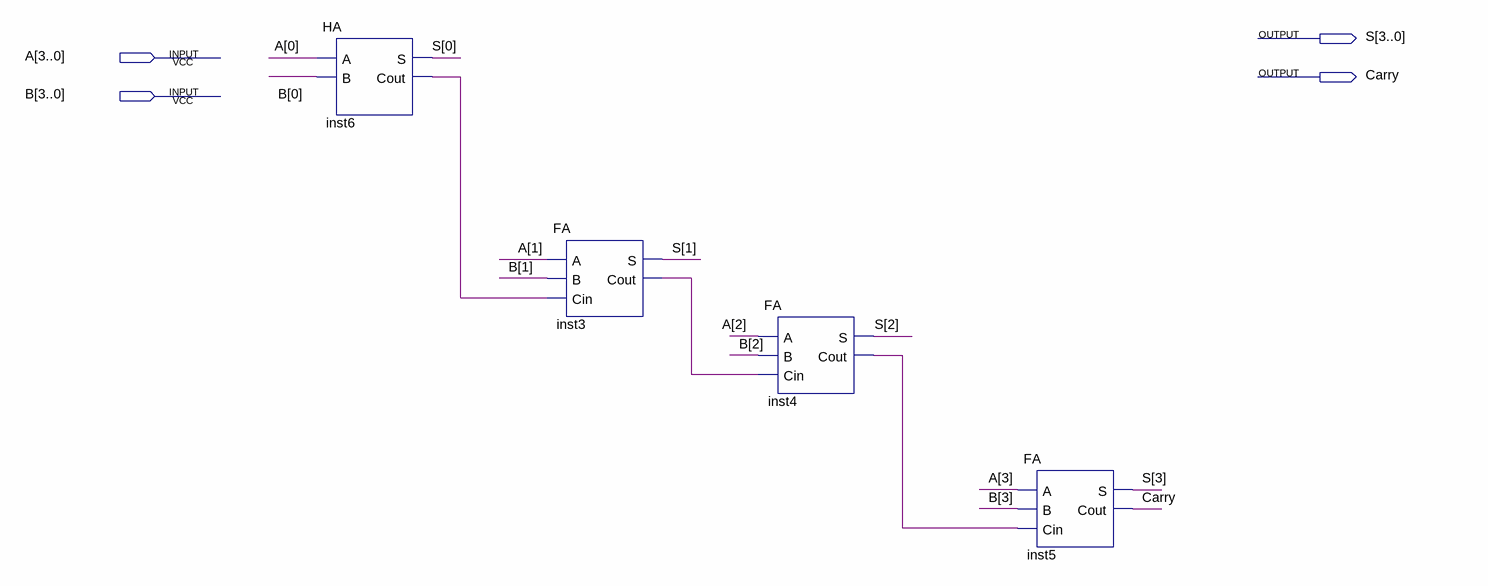
[diagram p0: schematic sheet]
// Quartus schematic Lab01.bdf as structural Verilog: 4 symbols, 4 pins
module Lab01 (
  input  [3:0] A,
  input  [3:0] B,
  output [3:0] S,
  output Carry
);

  wire inst3_cout, inst4_cout, inst6_cout;

  HA inst6 (.A(A[0]), .B(B[0]), .S(S[0]), .Cout(inst6_cout));
  FA inst3 (.A(A[1]), .B(B[1]), .Cin(inst6_cout), .S(S[1]), .Cout(inst3_cout));
  FA inst4 (.A(A[2]), .B(B[2]), .Cin(inst3_cout), .S(S[2]), .Cout(inst4_cout));
  FA inst5 (.A(A[3]), .B(B[3]), .Cin(inst4_cout), .S(S[3]), .Cout(Carry));
endmodule
